# EAGLE design tracker03-07 (EAGLE 7.2.0)
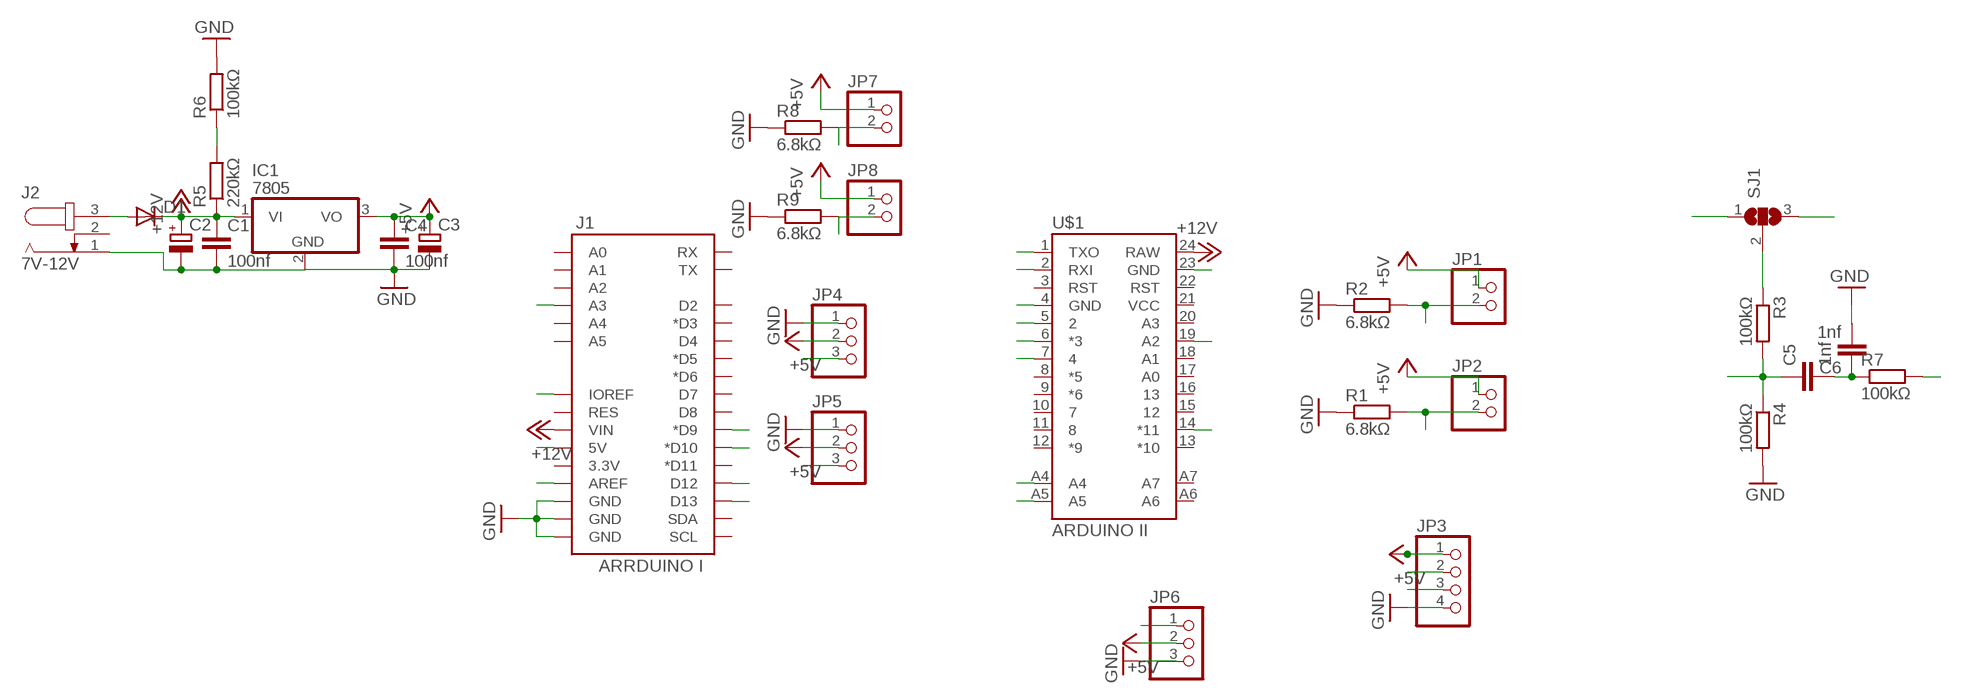
[diagram p0: schematic, sheet 1]

## Parts
C1  100nf  C-EU050-025X075  [C050-025X075]
C2  CPOL-EUE3.5-8  [E3,5-8]
C3  CPOL-EUE2.5-5  [E2,5-5]
C4  100nf  C-EU050-025X075  [C050-025X075]
C5  1nf  C-EU050-025X075  [C050-025X075]
C6  1nf  C-EU050-025X075  [C050-025X075]
D1  1N4004  [DO41-10]
IC1  7805  7805TV  [TO220V]
J1  ARRDUINO I  ARDUINO_R3_SHIELDNOLABELS  [UNO_R3_SHIELD_NOLABELS]
J2  7V-12V  JACK-PLUG0  [SPC4077]
JP1  PINHD-1X2  [1X02]
JP2  PINHD-1X2  [1X02]
JP3  PINHD-1X4  [1X04]
JP4  PINHD-1X3  [1X03]
JP5  PINHD-1X3  [1X03]
JP6  PINHD-1X3  [1X03]
JP7  PINHD-1X2  [1X02]
JP8  PINHD-1X2  [1X02]
R1  6.8kΩ  R-EU_0204/2V  [0204V]
R2  6.8kΩ  R-EU_0204/2V  [0204V]
R3  100kΩ  R-EU_0204/2V  [0204V]
R4  100kΩ  R-EU_0204/2V  [0204V]
R5  220kΩ  R-EU_0204/2V  [0204V]
R6  100kΩ  R-EU_0204/2V  [0204V]
R7  100kΩ  R-EU_0204/2V  [0204V]
R8  6.8kΩ  R-EU_0204/2V  [0204V]
R9  6.8kΩ  R-EU_0204/2V  [0204V]
SJ1  SJ2W  [SJ_2]
U$1  ARDUINO II  ARDUINO_PRO_MINI  [ARDUINO_PRO_MINI]

## Nets
5VA: J1.5V SJ1.3
+5V: C3.+ C4.1 IC1.3(VO) JP1.1 JP2.1 JP3.1 JP4.2 JP5.2 JP6.2 JP7.1 JP8.1
+12V: C1.1 C2.+ D1.C IC1.1(VI) J1.VIN R5.1 U$1.24(RAW)
A2: R5.2 R6.1 U$1.19(A2)
A3: C5.1 J1.A3 R3.2 R4.1
A4: JP3.2 U$1.A4
A5: JP3.3 U$1.A5
AREF: J1.AREF SJ1.1
AUDIO: R7.2
D2: JP1.2 R2.2 U$1.5
D3: U$1.6(*3)
D4: JP2.2 R1.2 U$1.7
D9: J1.D9(*D9) JP4.3
D10: J1.D10(*D10) JP5.3
D11: JP6.1 U$1.14(*11)
D12: J1.D12 JP7.2 R8.2
D13: J1.D13 JP8.2 R9.2
GND: C1.2 C2.- C3.- C4.2 C6.2 IC1.2(GND) J1.GND@0(GND) J1.GND@1(GND) J1.GND@2(GND) J2.1 JP3.4 JP4.1 JP5.1 JP6.3 R1.1 R2.1 R4.2 R6.2 R8.1 R9.1 U$1.4(GND) U$1.23(GND)
N$4: D1.A J2.3
N$6: R3.1 SJ1.2
N$7: J1.IOREF
N$999: C5.2 C6.1 R7.1
RX: U$1.2(RXI)
TX: U$1.1(TXO)
Unconnected: J1.3.3V J1.A0 J1.A1 J1.A2 J1.A4 J1.A5 J1.D2 J1.D3(*D3) J1.D4 J1.D5(*D5) J1.D6(*D6) J1.D7 J1.D8 J1.D11(*D11) J1.RES J1.RX J1.SCL J1.SDA J1.TX J2.2 U$1.3(RST) U$1.8(*5) U$1.9(*6) U$1.10 U$1.11 U$1.12(*9) U$1.13(*10) U$1.15 U$1.16 U$1.17(A0) U$1.18(A1) U$1.20(A3) U$1.21(VCC) U$1.22(RST) U$1.A6 U$1.A7

## Library data of the parts
C1 C4-C6 = rcl:C-EU: CAPACITOR, European symbol
C2 C3 = rcl:CPOL-EU: POLARIZED CAPACITOR, European symbol
D1 = diode:1N4004: DIODE general purpose rectifier, 1 A
IC1 = linear:78*: Positive VOLTAGE REGULATOR Source: http://cache.national.com/ds/LM/LM78L05.pdf http://www.fairchildsemi.com/ds/LM/LM7805.pdf
J1 = SparkFun-Boards:ARDUINO_R3_SHIELD: Shield form compatible with the Arduino Uno R3.
J2 = con-jack:JACK-PLUG: DC POWER JACK Power Jack, DC, Right Angle, Through Hole, Rated 5A at 16VDC, PC Terminals Distributor: Farnell (www.Farnell.de) Drawing: 84N1161.pdf / 84N1162.pdf Manufacturer: SPC Technology (www.spctechnology.com) Type: SPC4077 / SPC 4078; OC_FARNELL: unknown; OC_NEWARK: unknown
JP1 JP2 JP7 JP8 = pinhead:PINHD-1X2: PIN HEADER
JP3 = pinhead:PINHD-1X4: PIN HEADER
JP4-JP6 = pinhead:PINHD-1X3: PIN HEADER
R1-R9 = rcl:R-EU_: RESISTOR, European symbol
SJ1 = jumper:SJ2W: SMD solder JUMPER
U$1 = SparkFun-Boards:ARDUINO_PRO_MINI

## Board
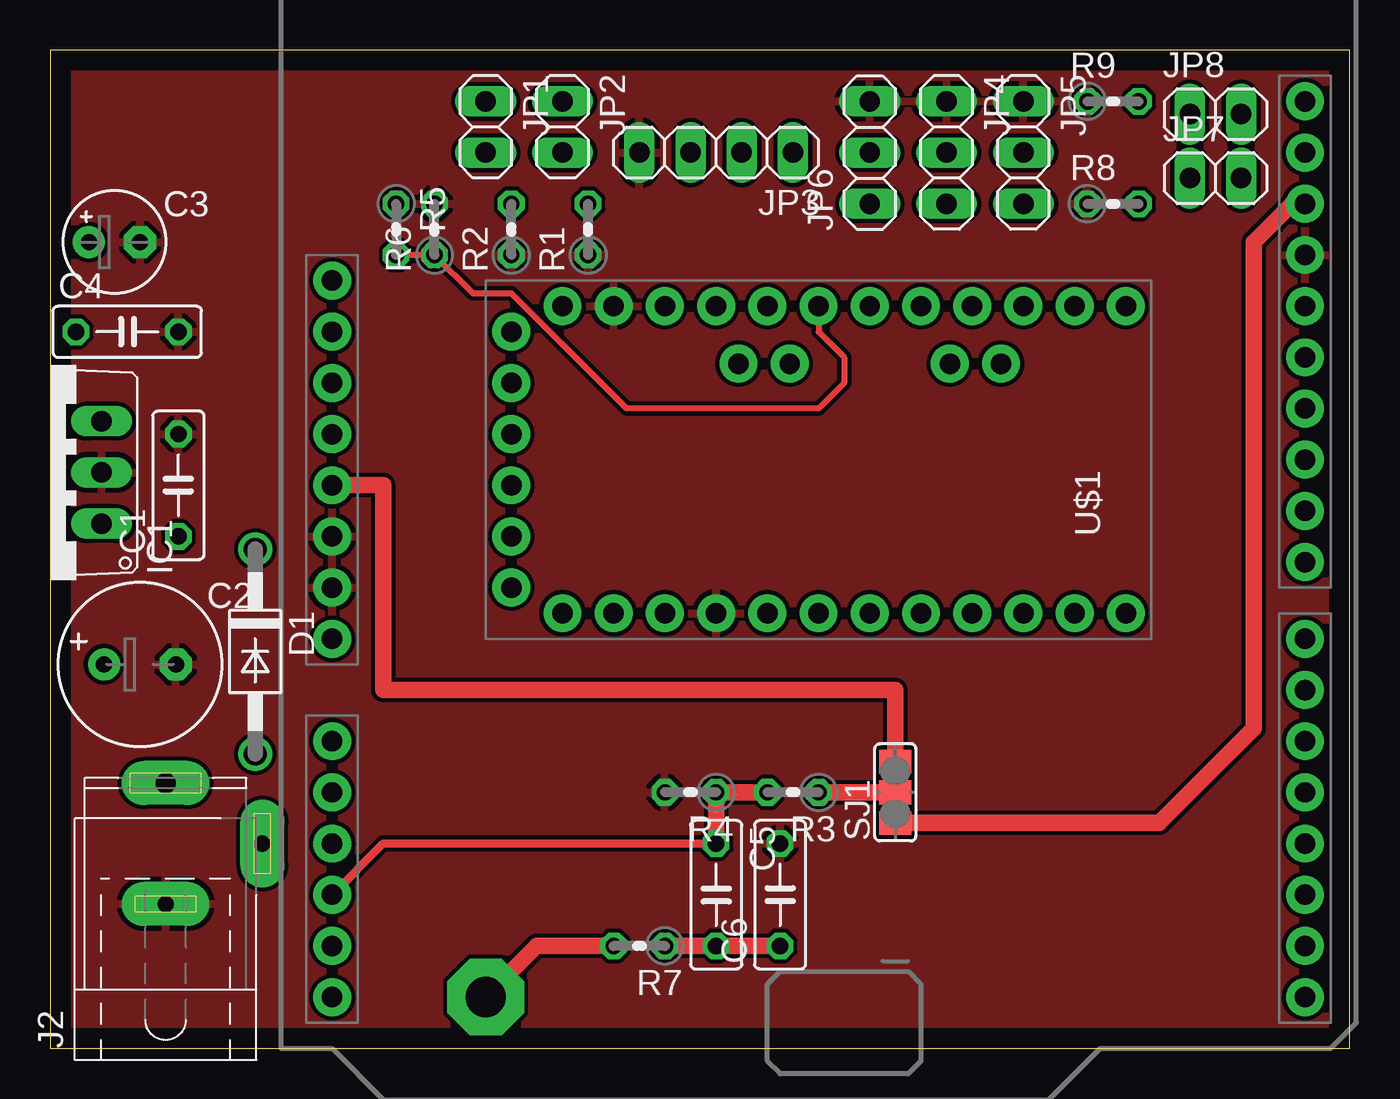
[diagram p1: board, top side]
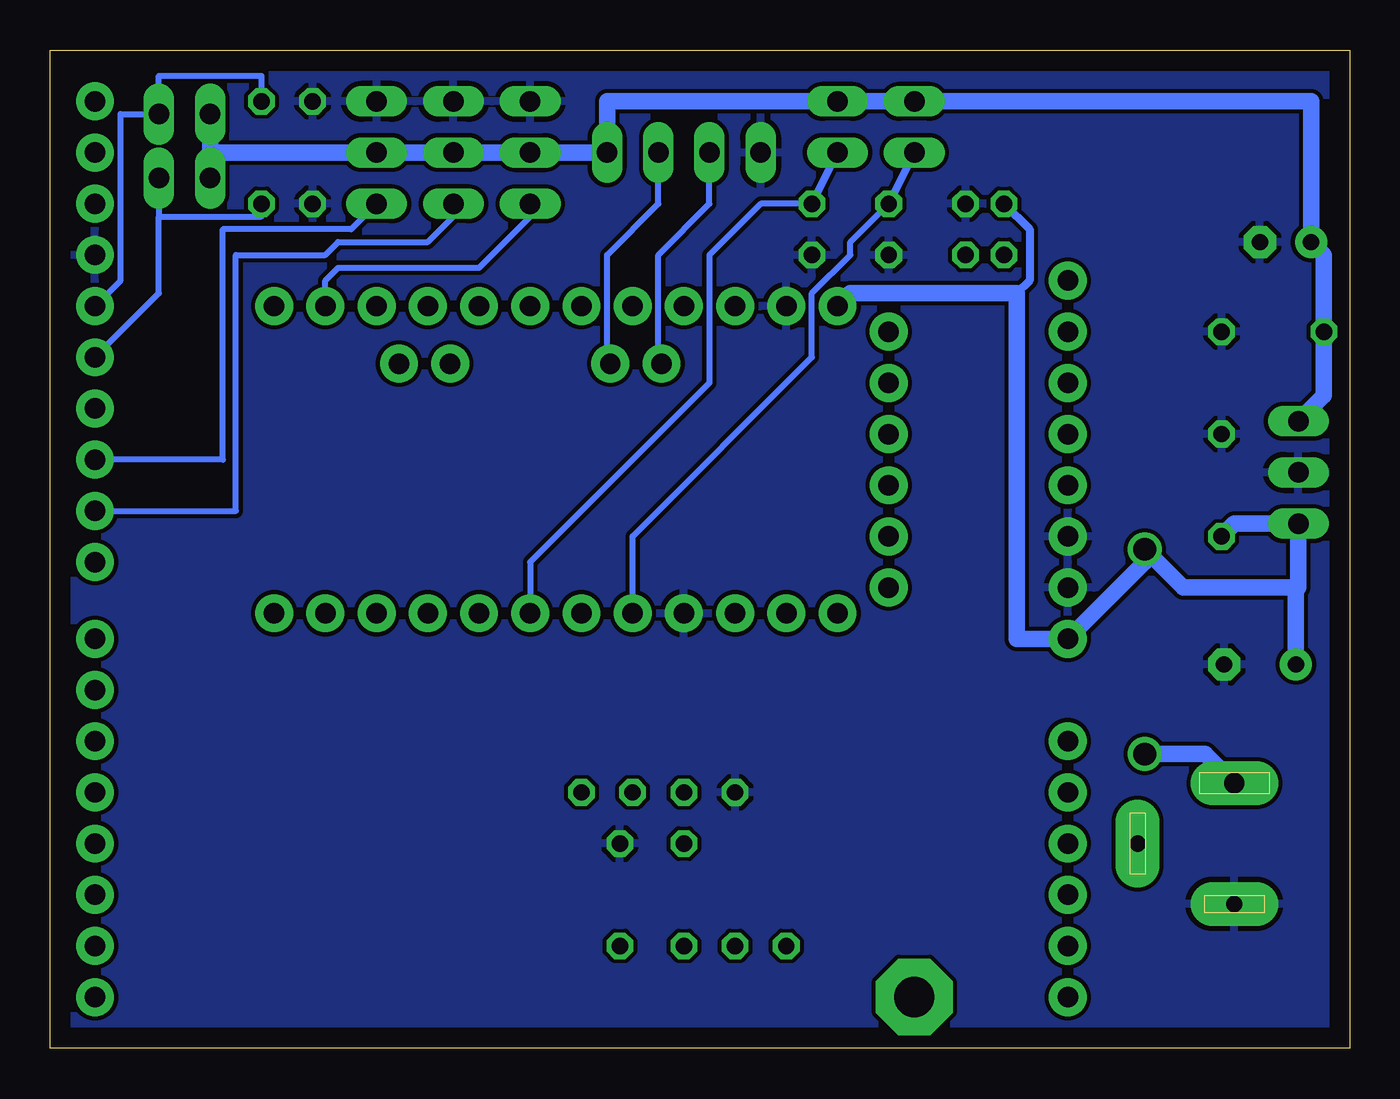
[diagram p2: board, bottom side, seen from below]

Size 64.44 x 49.52 mm. Coordinates in mm from the lower left corner, seen from the top.
Outline: 0,0 64.44,0 64.44,49.52 0,49.52 0,0
Copper layers (1*16): Top 0.035mm / dielectric 1.5mm / Bottom 0.035mm
Design rules "default": minimum track width 10mil, minimum drill 24mil, track to track 8mil, track to pad 8mil, pad to pad 8mil, via to via 8mil, smd to smd 8mil, copper to edge 40mil, drill to drill 8mil, minimum pad ring 10mil, minimum via ring 8mil, stop-mask expansion 4mil, vias tented up to drill 0mil, thermal gap 10mil

### Footprints (pad centres in the part's own frame; a part is rotated, then mirrored left to right if it is on the bottom)
C050-025X075 = drill 0.813 octagon: 1 -2.54,0; 2 2.54,0
E3,5-8 = drill 0.813 pad 1.6: + -1.778,0 | drill 0.813 pad 1.6 octagon: - 1.778,0
E2,5-5 = drill 0.813 pad 1.6: + -1.27,0 | drill 0.813 pad 1.6 octagon: - 1.27,0
DO41-10 = drill 1.118: A 5.08,0; C -5.08,0
TO220V = drill 1.016 long: 1 -2.54,-2.54; 2 0,-2.54; 3 2.54,-2.54
UNO_R3_SHIELD_NOLABELS = drill 1.016 pad 1.88: 3.3V 50.8,26.67; 5V 50.8,29.21; A0 50.8,41.91; A1 50.8,44.45; A2 50.8,46.99; A3 50.8,49.53; A4 50.8,52.07; A5 50.8,54.61; AREF 2.54,15.24; D2 2.54,49.53; D3 2.54,46.99; D4 2.54,44.45; D5 2.54,41.91; D6 2.54,39.37; D7 2.54,36.83; D8 2.54,33.02; D9 2.54,30.48; D10 2.54,27.94; D11 2.54,25.4; D12 2.54,22.86; D13 2.54,20.32; GND@0 50.8,31.75; GND@1 50.8,34.29; GND@2 2.54,17.78; IOREF 50.8,21.59; NC 50.8,19.05; RES 50.8,24.13; RX 2.54,54.61; SCL 2.54,10.16; SDA 2.54,12.7; TX 2.54,52.07; VIN 50.8,36.83
SPC4077 = drill 0.8 pad 2.184 long: 1 -3,0; 2 0,-4.8 | drill 1 pad 2.184 long: 3 3,0
1X02 = drill 1.016 long: 1 -1.27,0; 2 1.27,0
1X04 = drill 1.016 long: 1 -3.81,0; 2 -1.27,0; 3 1.27,0; 4 3.81,0
1X03 = drill 1.016 long: 1 -2.54,0; 2 0,0; 3 2.54,0
0204V = drill 0.813 octagon: 1 -1.27,0; 2 1.27,0
SJ_2 = smd 1.168 x 1.6: 1 -1.524,0; 2 0,0; 3 1.524,0
ARDUINO_PRO_MINI = drill 1.016 pad 1.88: 1 -7.62,12.7; 2 -7.62,10.16; 3 -7.62,7.62; 4 -7.62,5.08; 5 -7.62,2.54; 6 -7.62,0; 7 -7.62,-2.54; 8 -7.62,-5.08; 9 -7.62,-7.62; 10 -7.62,-10.16; 11 -7.62,-12.7; 12 -7.62,-15.24; 13 7.62,-15.24; 14 7.62,-12.7; 15 7.62,-10.16; 16 7.62,-7.62; 17 7.62,-5.08; 18 7.62,-2.54; 19 7.62,0; 20 7.62,2.54; 21 7.62,5.08; 22 7.62,7.62; 23 7.62,10.16; 24 7.62,12.7; A4 4.763,1.429; A5 4.763,3.969; A6 4.763,-9.049; A7 4.763,-6.509; BLK -6.35,15.24; GND -3.81,15.24; GRN 6.35,15.24; RXI 1.27,15.24; TXO 3.81,15.24; VCC -1.27,15.24

### Placement (x,y rotation side)
C1  6.35,27.94 90 top
C2  4.45,19.05 0 top
C3  3.18,40.01 0 top
C4  3.81,35.56 0 top
C5  33.02,7.62 270 top
C6  36.2,7.62 90 top
D1  10.16,19.68 270 top
IC1  0,28.57 90 top
J1  64.77,57.15 180 top
J2  5.71,10.16 90 top
JP1  21.59,45.72 270 top
JP2  25.4,45.72 270 top
JP3  33.02,44.45 180 top
JP4  44.45,44.45 270 top
JP5  48.26,44.45 270 top
JP6  40.64,44.45 90 top
JP7  57.78,43.18 0 top
JP8  57.78,46.35 0 top
R1  26.67,40.64 90 top
R2  22.86,40.64 90 top
R3  36.83,12.7 180 top
R4  31.75,12.7 180 top
R5  17.14,40.64 270 top
R6  19.05,40.64 90 top
R7  29.21,5.08 180 top
R8  52.7,41.91 0 top
R9  52.7,46.99 0 top
SJ1  41.91,12.7 90 top
U$1  38.1,29.21 90 top

### Tracks (layer width: path | path; a pad name or v marks a point on that pad's centre or on a via)
5VA
  Top 0.813: SJ1.3 41.91,17.78 16.51,17.78 16.51,27.94 J1.5V
+5V
  Bottom 0.813: IC1.3 1.27,32.38 C4.1 1.27,39.37 C3.+ 1.9,46.99 JP1.1 JP2.1 36.83,46.99 JP3.1 JP6.2 JP4.2 JP5.2 56.51,44.45 JP7.1 JP8.1
+12V
  Bottom 0.406: R5.1 15.88,40.64 15.88,38.1 16.51,37.47
  Bottom 0.813: 2.54,22.86 8.26,22.86 D1.C 10.16,24.13 J1.VIN 16.51,20.32 16.51,37.47 24.77,37.47 U$1.24 | 2.54,22.86 IC1.1 5.71,26.04 C1.1 | 2.54,22.86 2.67,22.73 C2.+
A2
  Top 0.305: U$1.19 38.1,35.56 39.37,34.29 39.37,33.02 38.1,31.75 28.57,31.75 22.86,37.47 20.96,37.47 R6.1 R5.2
A3
  Top 0.406: J1.A3 16.51,10.16 C5.1
  Top 0.813: C5.1 R4.1 R3.2
A4
  Bottom 0.254: 36.83,34.29 36.83,33.97 U$1.A4
  Bottom 0.305: 36.83,34.13 36.83,34.29 36.83,39.37 34.29,41.91 JP3.2
A5
  Bottom 0.305: U$1.A5 34.29,34.13 34.29,39.37 31.75,41.91 JP3.3
AREF
  Top 0.813: J1.AREF 61.59,41.91 59.69,40.01 59.69,15.88 54.99,11.18 SJ1.1
AUDIO  (via drill 2 pad 3.81)
  Top 0.813: R7.2 24.13,5.08 v21.59,2.54
D2
  Bottom 0.305: U$1.5 35.56,25.4 26.67,34.29 26.67,37.47 24.77,39.37 24.77,40.01 R2.2
  Bottom 0.406: JP1.2 R2.2
D4
  Bottom 0.305: R1.2 29.21,41.91 31.75,39.37 31.75,33.02 40.64,24.13 U$1.7
  Bottom 0.406: JP2.2 R1.2
D9
  Bottom 0.305: J1.D9 55.24,26.67 55.24,39.37 50.8,39.37 50.16,40.01 45.72,40.01 44.45,41.27 JP4.3
D10
  Bottom 0.305: J1.D10 55.88,29.21 55.88,40.64 49.53,40.64 JP5.3
D11
  Bottom 0.305: U$1.14 50.8,38.1 50.16,38.73 43.18,38.73 40.64,41.27 JP6.1
D12
  Bottom 0.305: J1.D12 59.05,37.47 59.05,41.27 | JP7.2 59.05,41.27 | 59.05,41.27 53.97,41.27 R8.2
D13
  Bottom 0.305: J1.D13 60.96,38.1 60.96,46.35 JP8.2 59.05,48.26 53.97,48.26 R9.2
GND
  pour Bottom: 0,0 64.77,0 64.77,49.53 0,49.53
  pour Top: 0,0 64.77,0 64.77,49.53 0,49.53
N$4
  Bottom 0.813: J2.3 7.16,14.61 D1.A
N$6
  Top 0.813: SJ1.2 R3.1
N$999
  Top 0.813: R7.1 C5.2 C6.1